# Altium schematic sheet mcu subsystem.SchDoc
size A; SheetNumber: 3; SheetTotal: 3
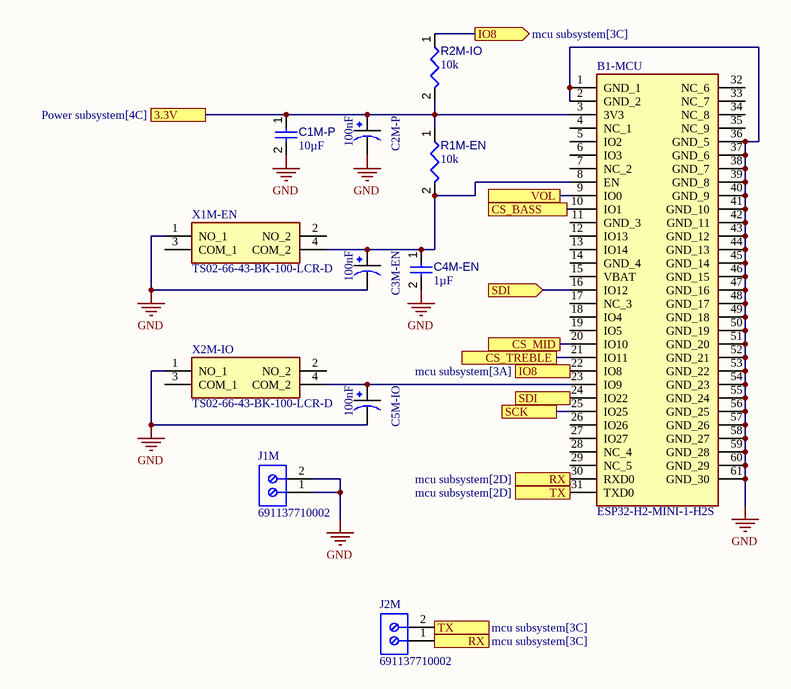
[diagram p0: mcu subsystem.SchDoc]

## Parts
B1-MCU  ESP32-H2-MINI-1-H2S  [ESP32H2MINI1H2S]
C1M-P  value 10µF  [CAPC3216X180X50NL20T25]  (hidden comment: Capacitor 10 uF +/- 10% 16 V 1206)
C2M-P  100nF  [*CAPPRD200W50D500H1100_EEUFR1E470(Primary)]
C3M-EN  100nF  [*CAPPRD200W50D500H1100_EEUFR1E470(Primary)]
C4M-EN  value 1µF  [CAPC3216X180X20ML20]  (hidden comment: Capacitor 1 uF +/- 10% 25 V 1206)
C5M-IO  100nF  [*CAPPRD200W50D500H1100_EEUFR1E470(Primary)]
J1M  691137710002  [691137710002]
J2M  691137710002  [691137710002]
R1M-EN  value 10k  [RESC3216X60X45ML15T20]  (hidden comment: Resistor 10k +/-1% 1206 250 mW)
R2M-IO  value 10k  [RESC3216X60X45ML15T20]  (hidden comment: Resistor 10k +/-1% 1206 250 mW)
X1M-EN  TS02-66-43-BK-100-LCR-D  [TS026643BK100LCRD]
X2M-IO  TS02-66-43-BK-100-LCR-D  [TS026643BK100LCRD]

## Ports
3.3V (see Power subsystem[4C]), CS_BASS (see preamp_with_digital_pot[3C]), CS_MID (see preamp_with_digital_pot[4C]), CS_TREBLE (see preamp_with_digital_pot[3D]), IO8 (in, see mcu subsystem[3A]), IO8 (out, see mcu subsystem[3C]), RX (see mcu subsystem[2D]), RX (see mcu subsystem[3C]), SCK (see preamp_with_digital_pot[3C], preamp_with_digital_pot[3D], preamp_with_digital_pot[4C], preamp_with_digital_pot[4D]), SDI (in, see mcu subsystem[3C], preamp_with_digital_pot[3C], preamp_with_digital_pot[3D], preamp_with_digital_pot[4C], preamp_with_digital_pot[4D]), SDI (out, see mcu subsystem[3B], preamp_with_digital_pot[3C], preamp_with_digital_pot[3D], preamp_with_digital_pot[4C], preamp_with_digital_pot[4D]), TX (see mcu subsystem[2D]), TX (see mcu subsystem[3C]), VOL (see preamp_with_digital_pot[4D])

## Nets
GND: B1-MCU.1(GND_1) B1-MCU.2(GND_2) B1-MCU.36(GND_5) B1-MCU.37(GND_6) B1-MCU.38(GND_7) B1-MCU.39(GND_8) B1-MCU.40(GND_9) B1-MCU.41(GND_10) B1-MCU.42(GND_11) B1-MCU.43(GND_12) B1-MCU.44(GND_13) B1-MCU.45(GND_14) B1-MCU.46(GND_15) B1-MCU.47(GND_16) B1-MCU.48(GND_17) B1-MCU.49(GND_18) B1-MCU.50(GND_19) B1-MCU.51(GND_20) B1-MCU.52(GND_21) B1-MCU.53(GND_22) B1-MCU.54(GND_23) B1-MCU.55(GND_24) B1-MCU.56(GND_25) B1-MCU.57(GND_26) B1-MCU.58(GND_27) B1-MCU.59(GND_28) B1-MCU.60(GND_29) B1-MCU.61(GND_30) C1M-P.2 C2M-P.N C3M-EN.N C4M-EN.2 C5M-IO.N J1M.1 J1M.2 X1M-EN.1(NO_1) X2M-IO.1(NO_1)
3.3V: B1-MCU.3(3V3) C1M-P.1 C2M-P.P R1M-EN.1 R2M-IO.2 ; port 3.3V
CS_BASS: B1-MCU.10(IO1) ; port CS_BASS
CS_MID: B1-MCU.20(IO10) ; port CS_MID
CS_TREBLE: B1-MCU.21(IO11) ; port CS_TREBLE
IO8: B1-MCU.22(IO8) R2M-IO.1 ; port IO8
RX: B1-MCU.30(RXD0) J2M.1 ; port RX
SCK: B1-MCU.25(IO25) ; port SCK
SDI: B1-MCU.16(IO12) B1-MCU.24(IO22) ; port SDI
TX: B1-MCU.31(TXD0) J2M.2 ; port TX
VOL: B1-MCU.9(IO0) ; port VOL
NetB1-MCU_8: B1-MCU.8(EN) C3M-EN.P C4M-EN.1 R1M-EN.2 X1M-EN.4(COM_2)
NetB1-MCU_23: B1-MCU.23(IO9) C5M-IO.P X2M-IO.4(COM_2)

Not connected (* = marked no-connect by the designer): B1-MCU 4(NC_1) 5(IO2) 6(IO3) 7(NC_2) 11(GND_3) 12(IO13) 13(IO14) 14(GND_4) 15(VBAT) 17(NC_3) 18(IO4) 19(IO5) 26(IO26) 27(IO27) 28(NC_4) 29(NC_5) 32(NC_6) 33(NC_7) 34(NC_8) 35(NC_9); X1M-EN 2(NO_2) 3(COM_1); X2M-IO 2(NO_2) 3(COM_1)

## Library data of the parts
B1-MCU = CMP-005-000000-1: 802.15.4, Bluetooth Bluetooth v5.3, Zigbee Transceiver Module 2.4GHz PCB Trace Surface Mount, 3V ~ 3.6V , -40C ~ 105C (TA); Manufacturer_Name: Espressif Systems; Geometry.Height: 2.55mm; Datasheet Link: https://documentation.espressif.com/api/resource/doc/file/nzV9jBYD/FILE/esp32-h2-mini-1_mini-1u_datasheet_en.pdf; Mouser Price/Stock: *; Source: ESP32-H2-MINI-1-H2S.SchLib; Design Item ID: ESP32-H2-MINI-1-H2S; Mouser Part Number: *; Manufacturer_Part_Number: ESP32-H2-MINI-1-H2S
C1M-P = CMP-001-00016-6: Chip Capacitor, 10 uF, +/- 10%, 16 V, 1206 (3216 Metric); Capacitor Type: Ceramic; Voltage Rating: 16V; Tolerance: 10%; Min Operating Temperature: -55°C; Pins: 2; Mounting Technology: SM; Case/Package: 1206; Max Operating Temperature: 125°C; RoHS Compliant: True
C2M-P C3M-EN C5M-IO = EEUFR1E470: Value: *
C4M-EN = CMP-001-00006-6: Chip Capacitor, 1 uF, +/- 10%, 25 V, 1206 (3216 Metric); Capacitor Type: Ceramic; Voltage Rating: 25V; Tolerance: 10%; Min Operating Temperature: -55°C; Pins: 2; Case/Package: 1206; Max Operating Temperature: 125°C; Mounting Technology: SM; RoHS Compliant: True
J1M J2M = CMP-1502-03324-2: NexarPartId: 78871135; Voltage Rating: 300V; Number of Contacts: 2; Current Rating: 16A; Lead Pitch: 5mm; Height: 11.6mm; Packaging: Box; RoHS: Non-Compliant; Contact Material: Nickel, Tin; Max Operating Temperature: 120°C; Number of Pins: 2; Min Operating Temperature: -30°C; Number of Rows: 1
R1M-EN R2M-IO = CMP-009-00016-5: Chip Resistor, 10 KOhm, +/- 1%, 0.25 W, -55 to 155 degC, 1206 (3216 Metric); Power: 250mW; Voltage Rating: 200V; Pins: 2; Max Operating Temperature: 155°C; Tolerance: 1%; RoHS Compliant: True; Case/Package: 1206; Min Operating Temperature: -55°C; Mounting Technology: SM
X1M-EN X2M-IO = CMP-011-00015-1: TS02-66-43-BK-100-LCR-D - 6 x 6 mm, 4.3 mm Actuator Height, 100 gf, Black, Long Crimped, Through Hole, SPST, Tactile Switch; Manufacturer_Name: Same Sky; Geometry.Height: 4.5mm; Mouser Price/Stock: https://www.mouser.co.uk/ProductDetail/Same-Sky/TS02-66-43-BK-100-LCR-D?qs=A6eO%252BMLsxmQKx8LKBmCQ6w%3D%3D; Design Item ID: TS02-66-43-BK-100-LCR-D; Manufacturer_Part_Number: TS02-66-43-BK-100-LCR-D; Datasheet Link: https://www.sameskydevices.com/product/resource/TS02-66-43-BK-100-LCR-D.pdf; Source: TS02-66-43-BK-100-LCR-D.SchLib; Mouser Part Number: 179-TS026643BK100LCR